# Altium schematic sheet LCD.SchDoc
size A4; CheckedBy: Danny.Wu; DrawnBy: Vae.Liu; Revision: V1.2; Code: SMART-EVB-G2
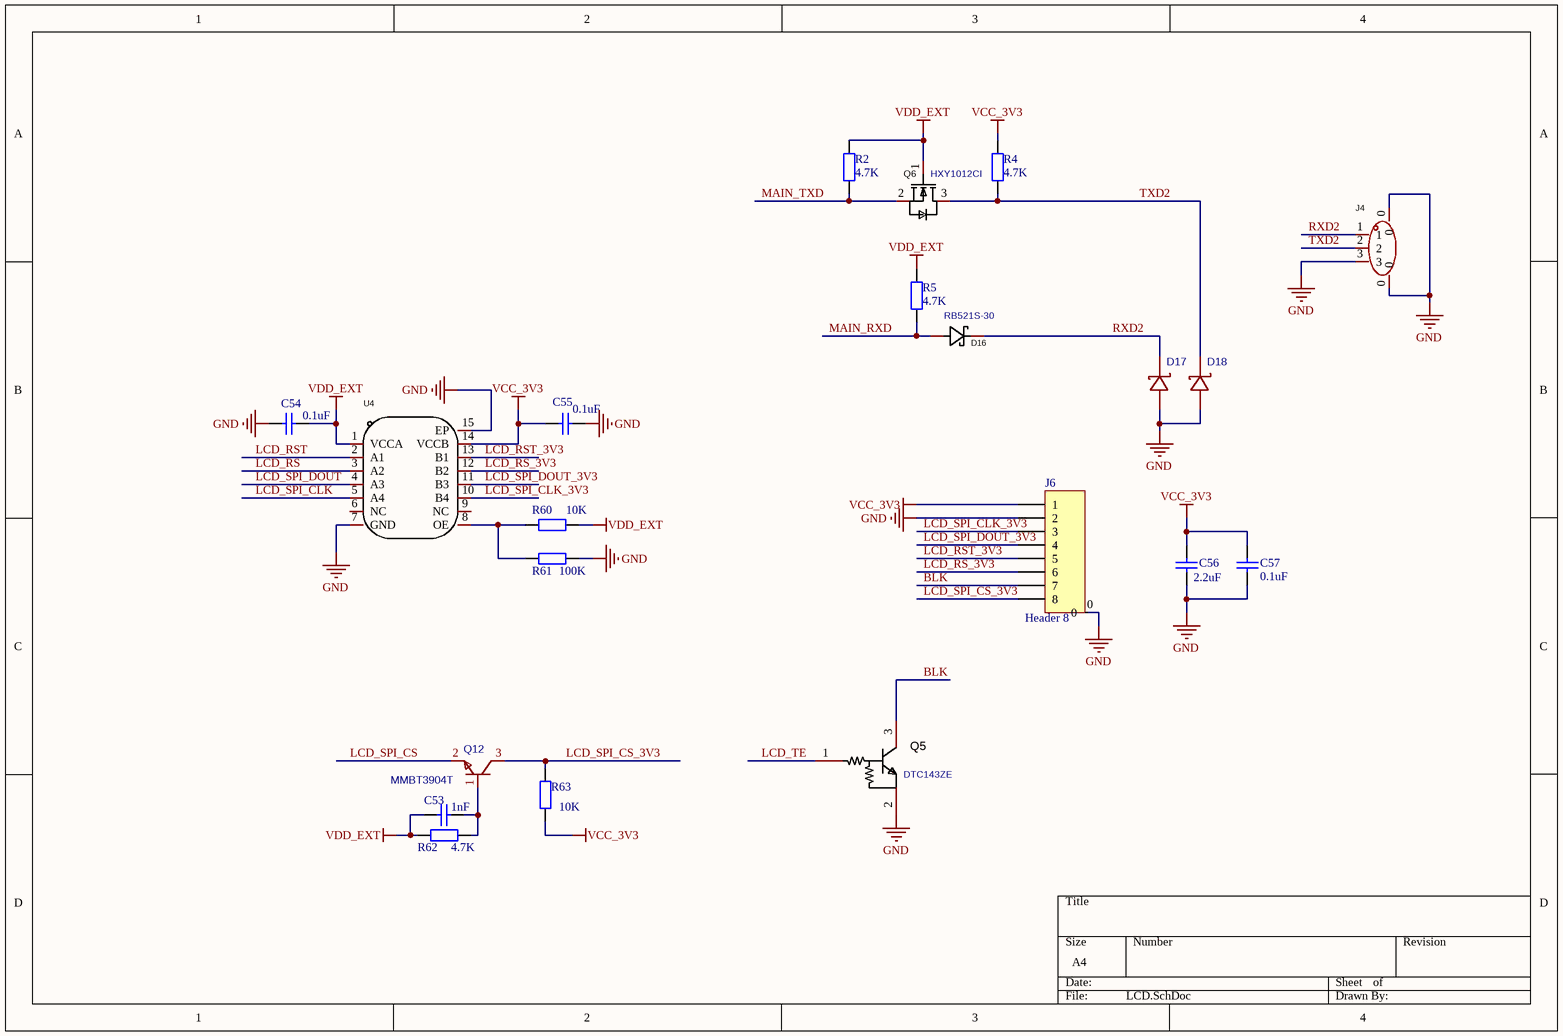
[diagram p0: LCD.SchDoc]

## Parts
C53  1nF  [0402C]
C54  0.1uF  [0402C]
C55  0.1uF  [0402C]
C56  value 2.2uF  [0402C]  (hidden comment: 4.7uF)
C57  0.1uF  [0402C]
D16  RB521S-30  [SOD-523_L1.2-W0.8-LS1.6-RD]
D17  LESD8LL5.0T5G  [SOD-882_L1.0-W0.6-RD]  (value not drawn)
D18  LESD8LL5.0T5G  [SOD-882_L1.0-W0.6-RD]  (value not drawn)
J4  HC-1.25-3PWT  [MX 1.25-WS-3P]  (value not drawn)
J6  Header 8  [MX 1.25-WS-8P]
Q5  DTC143ZE  [SOT-523]
Q6  HXY1012CI  [SOT-523]
Q12  MMBT3904T  [SOT-523]
R2  4.7K  [0402R]
R4  4.7K  [0402R]
R5  4.7K  [0402R]
R60  10K  [0402R]
R61  100K  [0402R]
R62  4.7K  [0402R]
R63  10K  [0402R]
U4  TXS0104ERGYR  [VQFN-14_L3.5-W3.5-P0.50-BL-EP]  (value not drawn)

## Nets
GND: C54.1 C55.2 C56.1 C57.1 D17.2(A) D18.2(A) J4.0 J4.3 J6.0 J6.2 Q5.2(E) R61.2 U4.7(GND) U4.15(EP)
VCC_3V3: C55.1 C56.2 C57.2 J6.1 R4.1 R63.1 U4.14(VCCB)
VDD_EXT: C53.1 C54.2 Q6.1(G) R2.1 R5.1 R60.1 R62.1 U4.1(VCCA)
BLK: J6.7 Q5.3(C)
LCD_RS: U4.3(A2)
LCD_RS_3V3: J6.6 U4.12(B2)
LCD_RST: U4.2(A1)
LCD_RST_3V3: J6.5 U4.13(B1)
LCD_SPI_CLK: U4.5(A4)
LCD_SPI_CLK_3V3: J6.3 U4.10(B4)
LCD_SPI_CS: Q12.2(E)
LCD_SPI_CS_3V3: J6.8 Q12.3(C) R63.2
LCD_SPI_DOUT: U4.4(A3)
LCD_SPI_DOUT_3V3: J6.4 U4.11(B3)
LCD_TE: Q5.1(B)
MAIN_RXD: D16.2(A) R5.2
MAIN_TXD: Q6.2(S) R2.2
RXD2: D16.1(C) D17.1(C) J4.1
TXD2: D18.1(C) J4.2 Q6.3(D) R4.2
NetC53_2: C53.2 Q12.1(B) R62.2
NetR60_2: R60.2 R61.1 U4.8(OE)

Not connected (* = marked no-connect by the designer): U4 6(NC) 9(NC)

## Library data of the parts
C53 = Cap: Capacitor; Value: 0.1uF; Published: 8-Jun-2000; LatestRevisionDate: 17-Jul-2002; LatestRevisionNote: Re-released for DXP Platform.; PackageReference: RAD-0.3; Publisher: Altium Limited
C54-C57 = Cap: Capacitor; Published: 8-Jun-2000; LatestRevisionDate: 17-Jul-2002; LatestRevisionNote: Re-released for DXP Platform.; PackageReference: RAD-0.3; Publisher: Altium Limited
D16 = 1N4148WT_C727112: DIODE; Manufacturer: TWGMC(台湾迪嘉); Add into BOM: yes; Reverse Recovery Time (trr): 4ns; Reverse Leakage Current: 1uA 75V; Forward Voltage (Vf@If): 1.25V 150mA; Power Dissipation: 150mW; Diode Configuration: 独立式; Average Rectified Current (Io): 100mA; Reverse Voltage (Vr): 75V; Name: RB521S-30; Symbol: RB521S-30; Device: RB521S-30; LCSC Part Name: RB521S-30; Supplier Part: C727120; Manufacturer Part: RB521S-30; Supplier Footprint: SOD-523; JLCPCB Part Class: Extended Part; Datasheet: https://atta.szlcsc.com/upload/public/pdf/source/20200828/C727112_FCA71CBB186A515518FBD85DA79D41CF.pdf; Supplier: LCSC; Convert to PCB: yes; Operating Temperature (Max): +150℃ (Tj); Operating Temperature (Min): -65℃ (Tj)
D17 D18 = LESD8LL5.0T5G: ESD; BOM_Manufacturer: LRC; Contributor: LCSC; BOM_Supplier Part: C172423; BOM_Supplier: LCSC; BOM_Manufacturer Part: LESD8LL5.0T5G; BOM_JLCPCB Part Class: Extended Part; spicePre: D; spiceSymbolName: LESD8LL5.0T5G
J4 = HC-1.25-3PWT: Connect; Manufacturer: HCTL(华灿天禄); Add into BOM: yes; Pins Structure: 1x3P; Pitch: 1.25mm; Reference Series: PicoBlade(MX 1.25); Number of PINs Per Row: 3; Current Rating (Max): 1A; Rated Voltage (Max): 125V; Plastic Material: LCP; Flame Retardant Rating: UL94V-0; Supplementary Features: 辅助焊脚; Z-Height of the Board: 3.57mm; X-Length of Bottom Edge on Board (Spacing Line): 8.8mm; Y-Width of Bottom Edge on Board: 5.25mm; Symbol: HC-1.25-3PWT; Device: HC-1.25-3PWT; LCSC Part Name: 1x3P 间距:1.25mm 卧贴 系列:PicoBlade(MX 1.25); Supplier Part: C2845380; Manufacturer Part: HC-1.25-3PWT; Supplier Footprint: SMD,P=1.25mm,卧贴; JLCPCB Part Class: Extended Part; Datasheet: https://atta.szlcsc.com/upload/public/pdf/source/20240930/9508A8292CCC87B0C29E3A028D56E30A.pdf; Supplier: LCSC; Convert to PCB: yes; Mounting Style: 卧贴; Number of Pins: 3P; Number of Rows: 1; Row Spacing: -; Contact Material: 黄铜; Contact Plating: 锡; Operating Temperature Range: -40℃~+105℃; Colour: -
J6 = Header 8: Header, 8-Pin; LatestRevisionDate: 17-Jul-2002; LatestRevisionNote: Re-released for DXP Platform.; Publisher: Altium Limited
Q5 = DTC143ZE_C248787: NPN; Manufacturer: TC(德昌); Add into BOM: yes; Power Dissipation (Pd): 150mW; Collector-Emitter Breakdown Voltage (Vceo): 50V; Collector Cut-Off Current (Icbo): 100nA; DC Current Gain (hFE@Ic,Vce): 350@10mA,5V; Transistor Type: 1个NPN-预偏置; Collector Current (Ic): 100mA; Collector-Emitter Saturation Voltage (VCE(sat)@Ic,Ib): 250mV@10mA,1mA; Input Resistor: 4.7kΩ; Name: DTC143ZE; Symbol: DTC143ZE_C248787; Device: DTC143ZE_C248787; LCSC Part Name: 电流:100mA 耐压:50V; Supplier Part: C248787; Manufacturer Part: DTC143ZE; Supplier Footprint: SOT-523-3; JLCPCB Part Class: Extended Part; Datasheet: https://atta.szlcsc.com/upload/public/pdf/source/20180801/C261279_47256D58AC18E2E55271AE832C186250.pdf; Supplier: LCSC; Convert to PCB: yes; Transition Frequency (fT): -; Input Voltage (VI(on)@Ic,Vce): -; Input Voltage (VI(off)@Ic,Vce): -; Output Voltage (VO(on)@Io/Ii): -; Resistor Ratio: -; Operating Temperature: -55℃~+150℃@(Tj)
Q6 = HXY1012CI: NMOS; Manufacturer: HXY MOSFET(华轩阳电子); Add into BOM: yes; Type: N沟道; Gate Threshold Voltage (Vgs(th)@Id): 1V@250uA; Drain Source Voltage (Vdss): 20V; Continuous Drain Current (Id): 800mA; Power Dissipation (Pd): 150mW; Drain Source On Resistance (RDS(on)@Vgs,Id): 350mΩ@4.5V; Input Capacitance (Ciss@Vds): 50pF; Name: HXY1012CI; Symbol: HXY1012CI; Device: HXY1012CI; LCSC Part Name: N沟道 耐压:20V 电流:800mA; Supplier Part: C5148644; Manufacturer Part: HXY1012CI; Supplier Footprint: SOT-523; Datasheet: https://atta.szlcsc.com/upload/public/pdf/source/20221216/7678D929A4495F210F49E57C2201325F.pdf; Supplier: LCSC; Convert to PCB: yes
Q12 = MMBT3904T: BOM_Manufacturer: CJ; BOM_Supplier: LCSC; BOM_Manufacturer Part: MMBT3904T; BOM_Supplier Part: C61616; BOM_JLCPCB Part Class: Extended Part; spicePre: Q; spiceSymbolName: MMBT3904T
R2 R4 R5 R62 = Res2: Resistor; Value: 10K; Published: 8-Jun-2000; LatestRevisionDate: 17-Jul-2002; LatestRevisionNote: Re-released for DXP Platform.; PackageReference: AXIAL-0.4; Publisher: Altium Limited
R60 R61 R63 = Res2: Resistor; Published: 8-Jun-2000; LatestRevisionDate: 17-Jul-2002; LatestRevisionNote: Re-released for DXP Platform.; PackageReference: AXIAL-0.4; Publisher: Altium Limited
U4 = TXS0104ERGYR: 电平转换IC; Manufacturer: TI(德州仪器); Add into BOM: yes; Symbol: TXS0104ERGYR; Device: TXS0104ERGYR; LCSC Part Name: TXS0104ERGYR; Supplier Part: C154926; Manufacturer Part: TXS0104ERGYR; Supplier Footprint: VQFN-14-EP(3.5x3.5); JLCPCB Part Class: Extended Part; Datasheet: https://www.ti.com/cn/lit/gpn/txs0104e; Supplier: LCSC; Convert to PCB: yes